# EAGLE design adapter_nucleo_f767 (EAGLE 9.5.0)
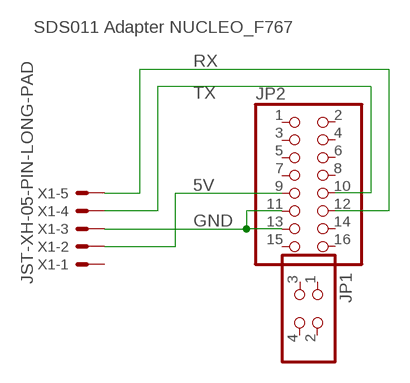
[diagram p0: schematic, sheet 1]

## Parts
JP1  PINHD-2X2  [2X02]
JP2  PINHD-2X8  [2X08]
X1  JST-XH-05-PIN-LONG-PAD  [JST-XH-05-PACKAGE-LONG-PAD]

## Nets
5V: JP2.9 X1.2
GND: JP2.11 JP2.13 X1.3
RX: JP2.12 X1.5
TX: JP2.10 X1.4
Unconnected: JP1.1 JP1.2 JP1.3 JP1.4 JP2.1 JP2.2 JP2.3 JP2.4 JP2.5 JP2.6 JP2.7 JP2.8 JP2.14 JP2.15 JP2.16 X1.1

## Notes on the sheet
- SDS011 Adapter NUCLEO_F767

## Library data of the parts
JP1 = pinhead:PINHD-2X2: PIN HEADER
JP2 = pinhead:PINHD-2X8: PIN HEADER
X1 = HSW_ATM-Connector_JST:JST-XH-05-PIN: JST XH Connector 2 Pin Wire to board connector. Pitch: 2,54 mm, (0.100") Number of pins: 5 Created by Rembrandt Electronics www.rembrandtelectronics.com

## Board
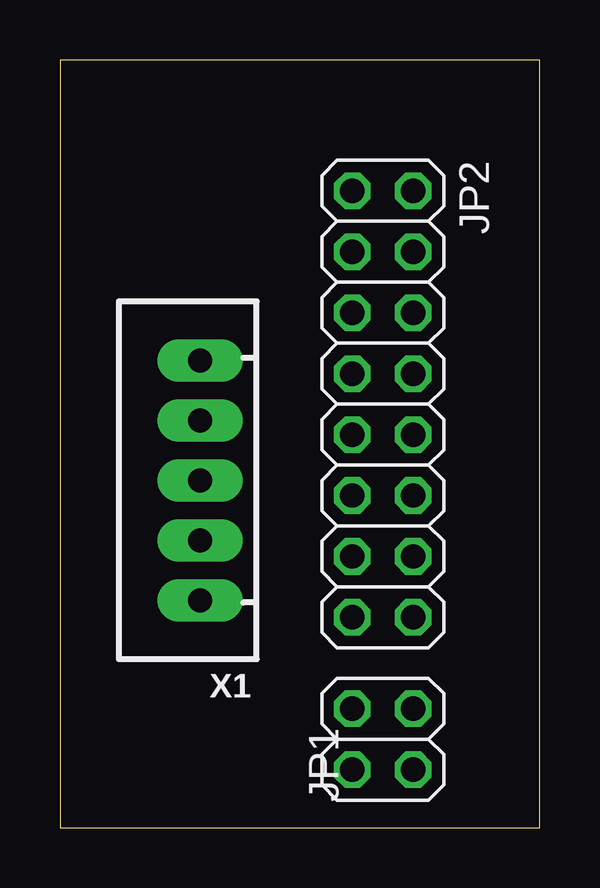
[diagram p1: board, top side]
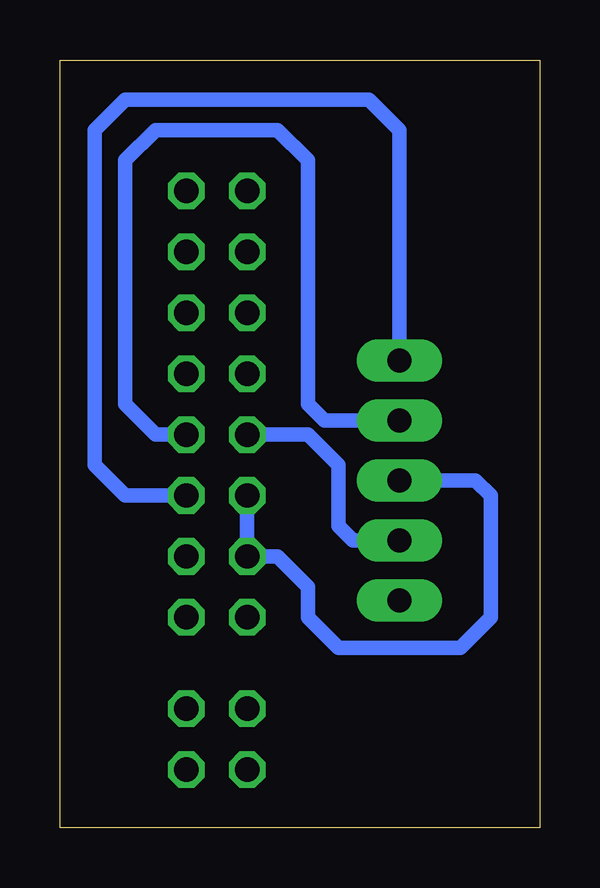
[diagram p2: board, bottom side, seen from below]

Size 20 x 32 mm. Coordinates in mm from the lower left corner, seen from the top.
Outline: 0,0 20,0 20,32 0,32 0,0
Copper layers (1*16): Top 0.035mm / dielectric 1.5mm / Bottom 0.035mm
Design rules "default": minimum track width 6mil, minimum drill 0.35mm, track to track 6mil, track to pad 6mil, pad to pad 6mil, via to via 6mil, smd to smd 6mil, copper to edge 40mil, drill to drill 6mil, minimum pad ring 10mil, minimum via ring 8mil, stop-mask expansion 4mil, vias tented up to drill 0mil, thermal gap 10mil

### Footprints (pad centres in the part's own frame; a part is rotated, then mirrored left to right if it is on the bottom)
2X02 = drill 1.016 octagon: 1 -1.27,-1.27; 2 -1.27,1.27; 3 1.27,-1.27; 4 1.27,1.27
2X08 = drill 1.016 octagon: 1 -8.89,-1.27; 2 -8.89,1.27; 3 -6.35,-1.27; 4 -6.35,1.27; 5 -3.81,-1.27; 6 -3.81,1.27; 7 -1.27,-1.27; 8 -1.27,1.27; 9 1.27,-1.27; 10 1.27,1.27; 11 3.81,-1.27; 12 3.81,1.27; 13 6.35,-1.27; 14 6.35,1.27; 15 8.89,-1.27; 16 8.89,1.27
JST-XH-05-PACKAGE-LONG-PAD = drill 1 pad 1.778 long: 1 -5,0; 2 -2.5,0; 3 0,0; 4 2.5,0; 5 5,0

### Placement (x,y rotation side)
JP1  13.46,3.68 90 top
JP2  13.46,17.65 270 top
X1  5.84,14.48 90 top

### Tracks (layer width: path | path; a pad name or v marks a point on that pad's centre or on a via)
5V
  Bottom 0.61: X1.2 7.79,11.98 8.38,12.57 8.38,15.11 9.65,16.38 JP2.9
GND
  Bottom 0.61: JP2.11 JP2.13 10.92,11.3 9.65,10.03 9.65,8.76 8.38,7.49 3.3,7.49 2.03,8.76 2.03,13.84 2.67,14.48 X1.3
RX
  Bottom 0.61: X1.5 5.84,29.08 7.11,30.35 17.27,30.35 18.54,29.08 18.54,15.11 17.27,13.84 JP2.12
TX
  Bottom 0.61: X1.4 8.98,16.98 9.65,17.65 9.65,27.81 10.92,29.08 16,29.08 17.27,27.81 17.27,17.65 16,16.38 JP2.10